# Altium schematic sheet TE0722.SchDoc: TE0722
size A4; Organization: Trenz Electronic GmbH; DocumentNumber: 8; Revision: 01; SheetNumber: 8; SheetTotal: 8; Date: 07.11.2014
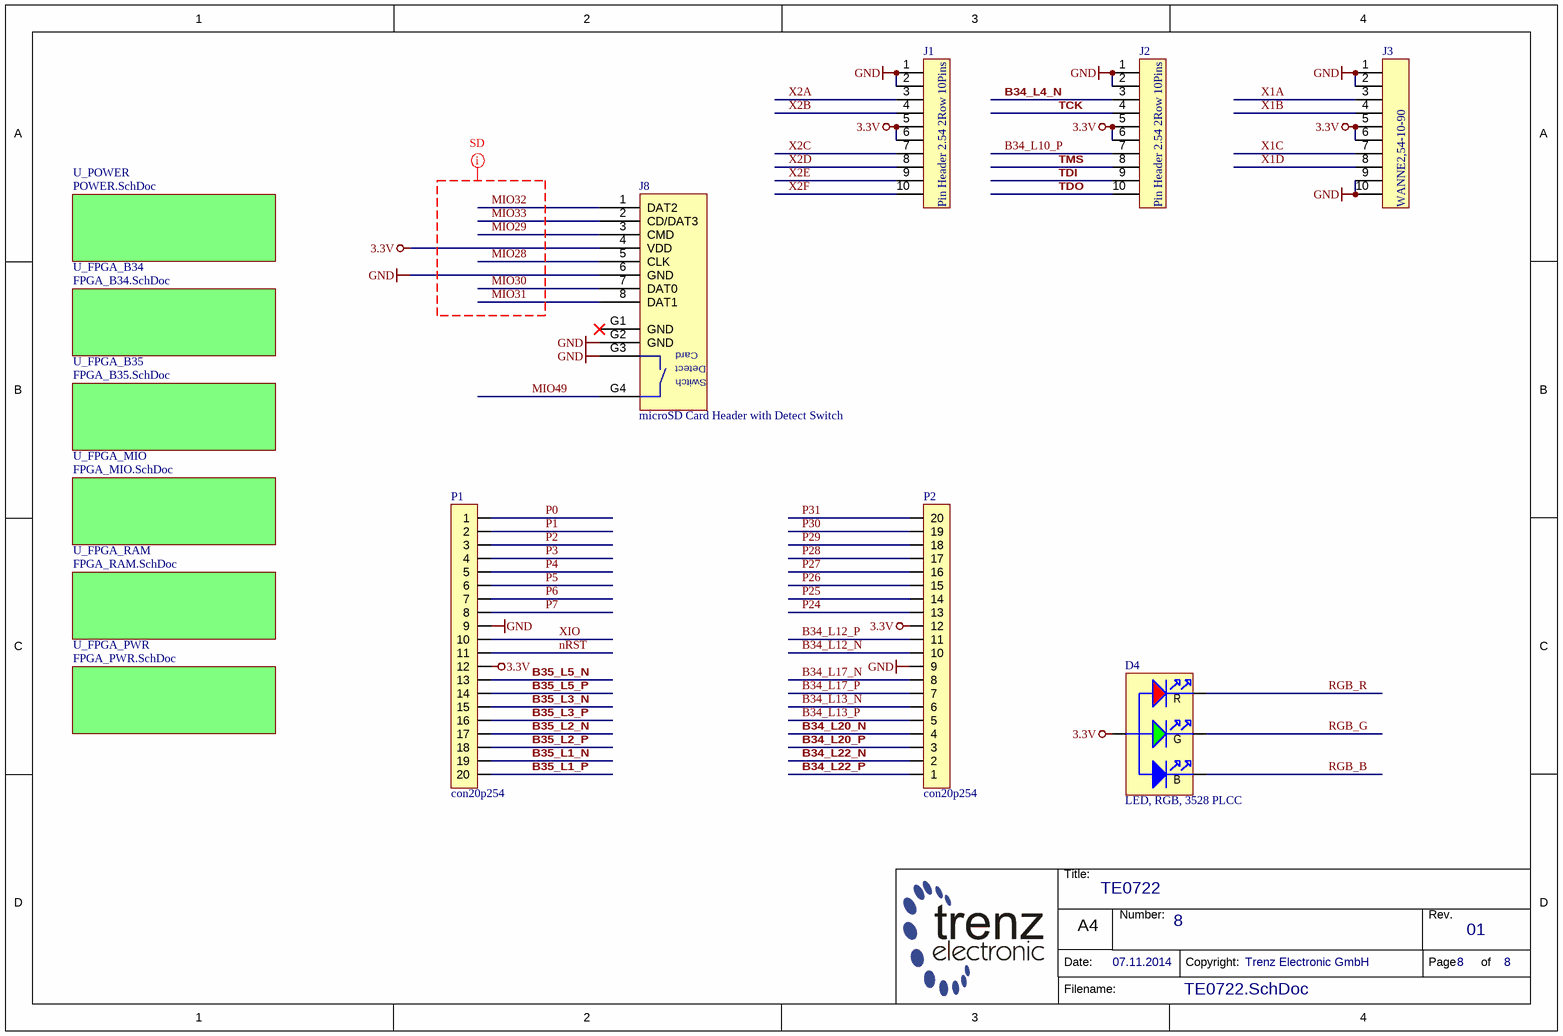
[diagram p0: TE0722.SchDoc]

## Parts
D4  LED, RGB, 3528 PLCC  [PLCC150P360X280X190-4N]
J1  Pin Header 2.54 2Row 10Pins  [STIFTLEISTE2_54 OG 2R-10]
J2  Pin Header 2.54 2Row 10Pins  [STIFTLEISTE2_54 OG 2R-10]
J3  WANNE2,54-10-90  [WANNE2,54-10-90]
J8  microSD Card Header with Detect Switch  [47309-2651]
P1  value con20p254  [con_20p254]  (hidden comment: con_20pin)
P2  value con20p254  [con_20p254]  (hidden comment: con_20pin)

## Sub-sheets
U_FPGA_B34 = FPGA_B34.SchDoc: no entries
U_FPGA_B35 = FPGA_B35.SchDoc: no entries
U_FPGA_MIO = FPGA_MIO.SchDoc: no entries
U_FPGA_PWR = FPGA_PWR.SchDoc: no entries
U_FPGA_RAM = FPGA_RAM.SchDoc: no entries
U_POWER = POWER.SchDoc: no entries

## Nets
3.3V: D4.3(ANODE) J1.5 J1.6 J2.5 J2.6 J3.5 J3.6 J8.4(VDD) P1.12 P2.12
GND: J1.1 J1.2 J2.1 J2.2 J3.1 J3.2 J3.9 J3.10 J8.6(GND) J8.G2(GND) J8.G3(POL) P1.9 P2.9
B34_L4_N: J2.3
B34_L10_P: J2.7
B34_L12_N: P2.10
B34_L12_P: P2.11
B34_L13_N: P2.6
B34_L13_P: P2.5
B34_L17_N: P2.8
B34_L17_P: P2.7
B34_L20_N: P2.4
B34_L20_P: P2.3
B34_L22_N: P2.2
B34_L22_P: P2.1
B35_L1_N: P1.19
B35_L1_P: P1.20
B35_L2_N: P1.17
B35_L2_P: P1.18
B35_L3_N: P1.15
B35_L3_P: P1.16
B35_L5_N: P1.13
B35_L5_P: P1.14
MIO28: J8.5(CLK)
MIO29: J8.3(CMD)
MIO30: J8.7(DAT0)
MIO31: J8.8(DAT1)
MIO32: J8.1(DAT2)
MIO33: J8.2(CD/DAT3)
MIO49: J8.G4(DET)
nRST: P1.11
P0: P1.1
P1: P1.2
P2: P1.3
P3: P1.4
P4: P1.5
P5: P1.6
P6: P1.7
P7: P1.8
P24: P2.13
P25: P2.14
P26: P2.15
P27: P2.16
P28: P2.17
P29: P2.18
P30: P2.19
P31: P2.20
RGB_B: D4.4(BLUE)
RGB_G: D4.2(GREEN)
RGB_R: D4.1(RED)
TCK: J2.4
TDI: J2.9
TDO: J2.10
TMS: J2.8
X1A: J3.3
X1B: J3.4
X1C: J3.7
X1D: J3.8
X2A: J1.3
X2B: J1.4
X2C: J1.7
X2D: J1.8
X2E: J1.9
X2F: J1.10
XIO: P1.10

Not connected (* = marked no-connect by the designer): J8 G1(GND)*

## Layout directives
net class SD: MIO28, MIO29, MIO30, MIO31, MIO32, MIO33

## Notes on the sheet
- Title:
- Number:
- Rev.
- Date:
- A4
- Copyright:
- Page
- of
- Filename:
- (in symbol 24994) Card; Detect; Switch
- (in symbol 26299) R; G; B

## Library data of the parts
D4 = 26299: AN: 26299; Mixed: SMT; Case: 3528 PLCC; HelpURL: B:\AD\adlib\datasheet\Multicomp-LED-RGB-PLCC
J1 J2 = 22402: Stiftleiste gerade 2-reihig, 10pol.; AN: 22402; Mixed: THT; Trenz-Stock: Yes
J3 = 20605: Stiftleiste Wanne 10polig 90°; AN: 20605; Mixed: THT; Trenz-Stock: Yes
J8 = 24994: AN: 24994; Mixed: SMT; Trenz-Stock: Yes; Case: microSD; HelpURL: B:\AD\adlib\datasheet\47309-2651; Preferred: Yes
P1 P2 = con20p254: con_20pin_254_1row; ID: 40; Component: con20p254